# Altium project MRv2.PrjPCB
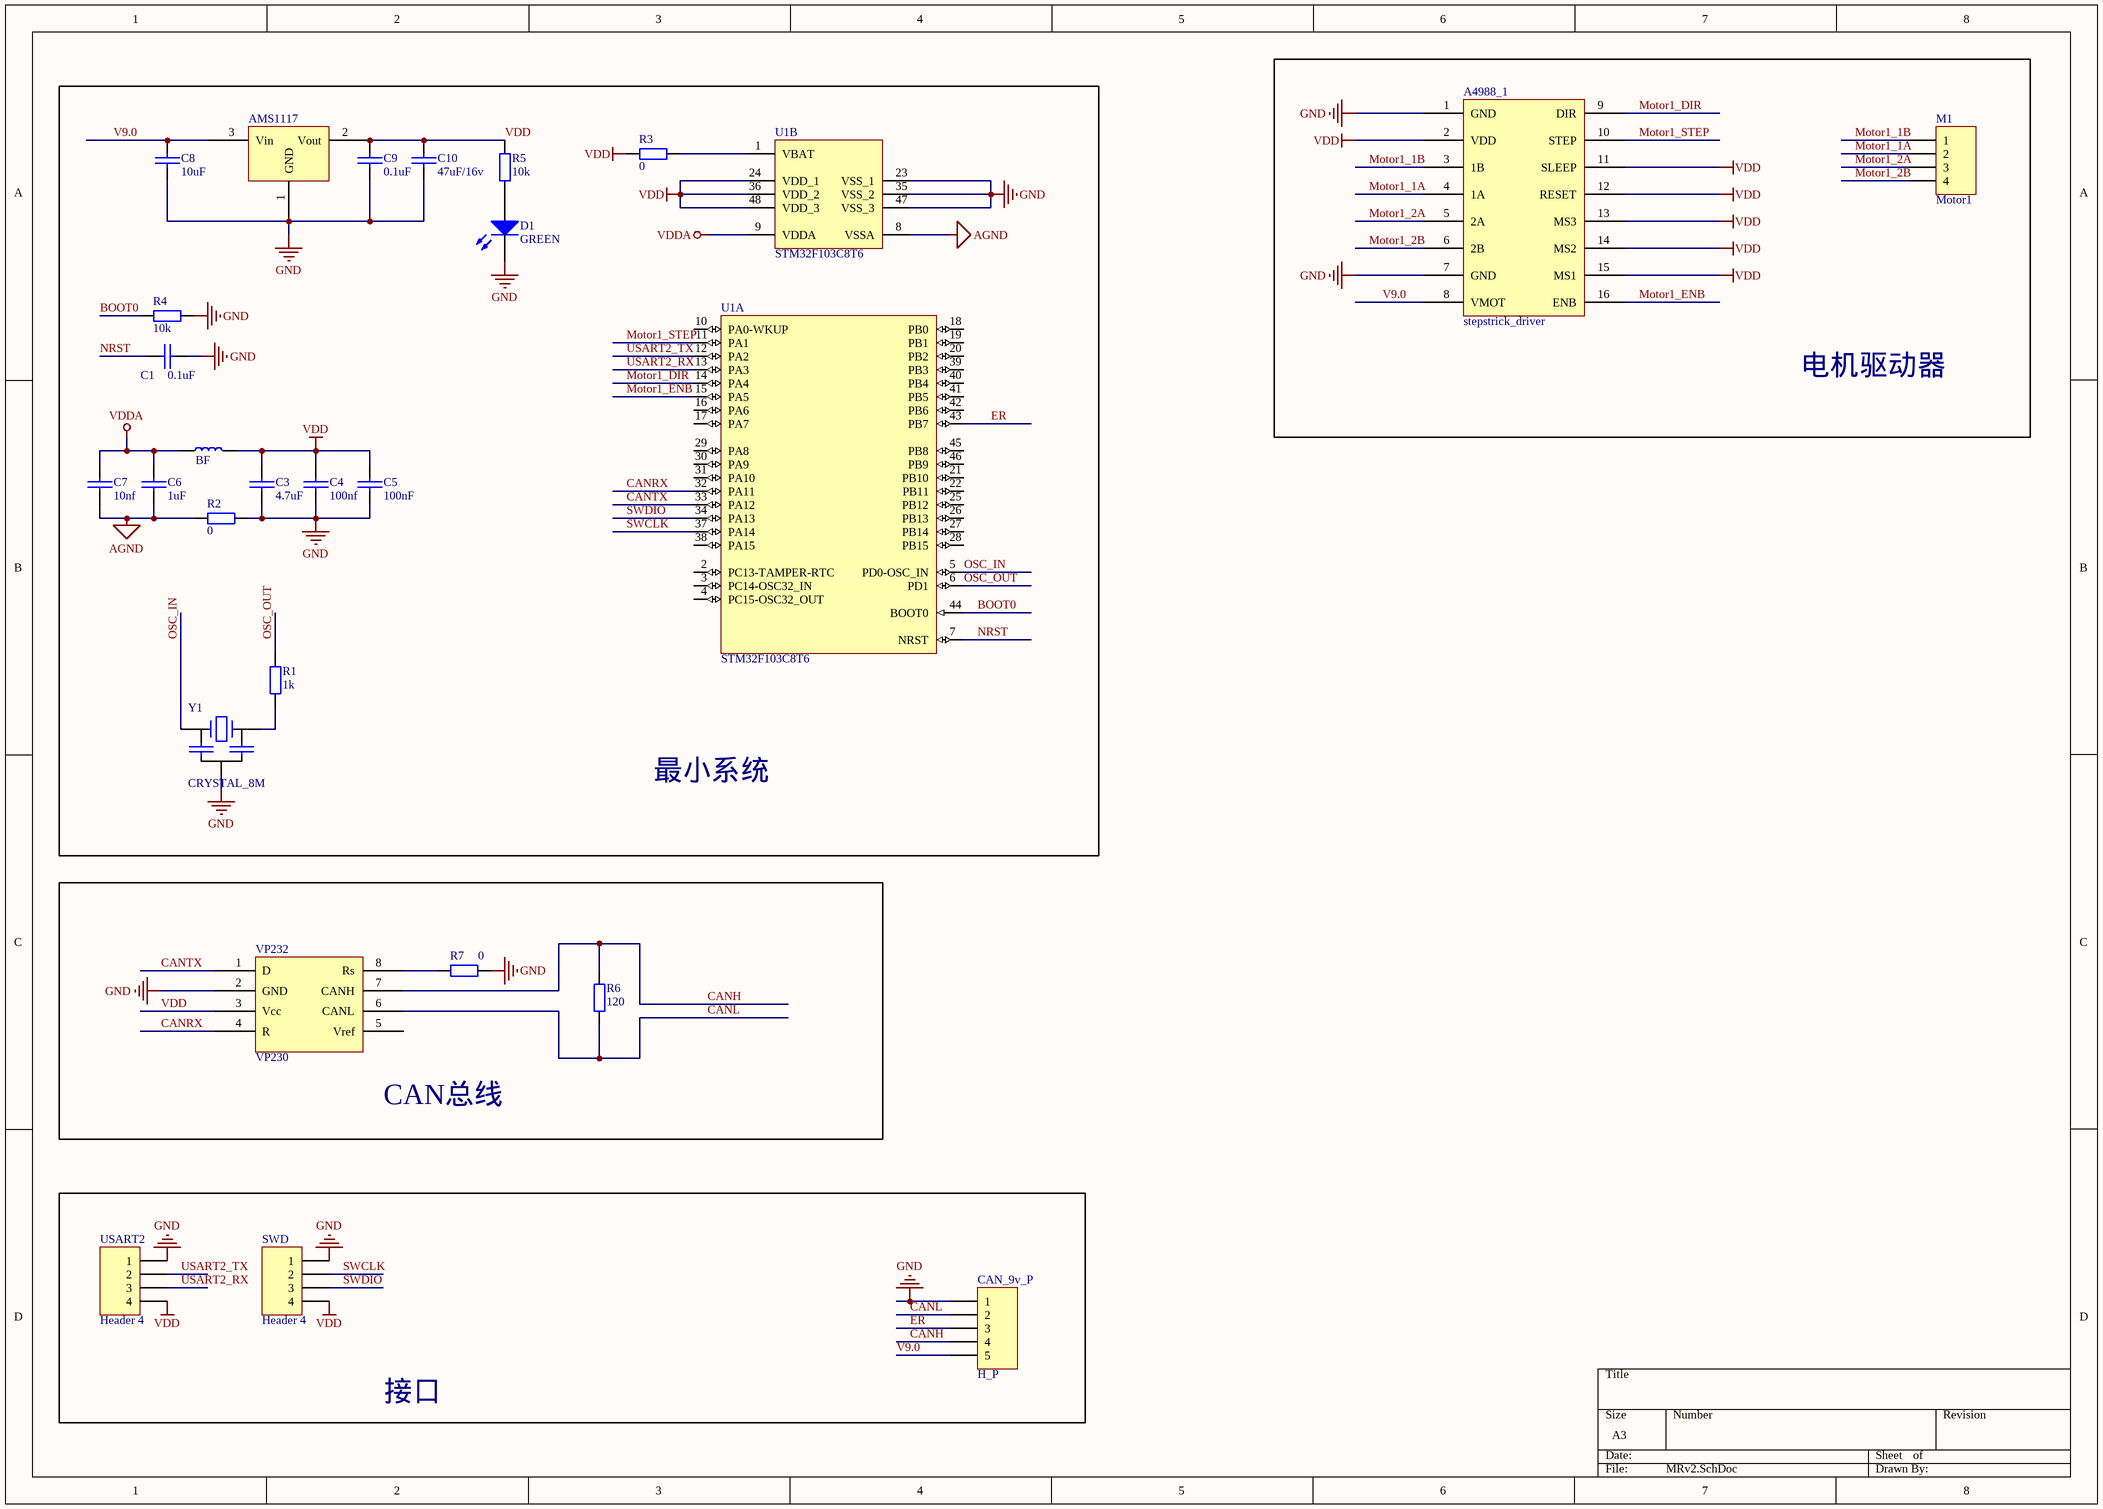
[diagram p0: MRv2.SchDoc]
1 sheet, 27 parts. Net scope: global (net labels, ports and power ports of the same name join across sheets).
Board file: MRv2.PcbDoc

## Sheet MRv2.SchDoc
size A3

### Parts
A4988_1  stepstrick_driver  [A4988]
AMS1117  ASM1117  [SOT223]  (value not drawn)
BF  BF  [R1608[0603]]  (value not drawn)
C1  value 0.1uF  [C1608[0603]N]  (hidden comment: cap smd)
C3  value 4.7uF  [C1608[0603]N]  (hidden comment: cap smd)
C4  value 100nf  [C1608[0603]N]  (hidden comment: cap smd)
C5  value 100nF  [C1608[0603]N]  (hidden comment: cap smd)
C6  value 1uF  [C1608[0603]N]  (hidden comment: cap smd)
C7  value 10nf  [C1608[0603]N]  (hidden comment: cap smd)
C8  value 10uF  [C1608[0603]N]  (hidden comment: cap smd)
C9  value 0.1uF  [C1608[0603]N]  (hidden comment: cap smd)
C10  value 47uF/16v  [C1608[0603]N]  (hidden comment: cap smd)
CAN_9v_P  H_P  [HDR1X5]
D1  value GREEN  [D1608[0603]]  (hidden comment: LED)
M1  Motor1  [HDR1X4]
R1  value 1k  [R1608[0603]]  (hidden comment: RES1)
R2  value 0  [R1608[0603]]  (hidden comment: RES1)
R3  value 0  [1608[0603]]  (hidden comment: RES1)
R4  value 10k  [1608[0603]]  (hidden comment: RES1)
R5  value 10k  [R1608[0603]]  (hidden comment: RES1)
R6  value 120  [R1608[0603]]  (hidden comment: RES1)
R7  value 0  [R1608[0603]]  (hidden comment: RES1)
SWD  Header 4  [HDR1X4]
U1  STM32F103C8T6  [LQFP48_N]  (parts A,B of 2)
USART2  Header 4  [HDR1X4]
VP232  VP230  [VP232]
Y1  CRYSTAL_8M  [Crystal_C]

### Blocks framed on the sheet
电机驱动器: A4988_1 M1
最小系统: AMS1117 BF C1 C3-C10 D1 R1-R5 U1 Y1
CAN总线: R6 R7 VP232
接口: CAN_9v_P SWD USART2

### Nets
AGND: C6.2 C7.2 R2.1 U1.8(VSSA)
GND: A4988_1.1(GND) A4988_1.7(GND) AMS1117.1(GND) C1.1 C3.2 C4.2 C5.2 C8.2 C9.2 C10.2 CAN_9v_P.1 D1.2(K) R2.2 R4.1 R7.2 SWD.1 U1.23(VSS_1) U1.35(VSS_2) U1.47(VSS_3) USART2.1 VP232.2(GND) Y1.2(GND)
VDD: A4988_1.2(VDD) A4988_1.11(SLEEP) A4988_1.12(RESET) A4988_1.13(MS3) A4988_1.14(MS2) A4988_1.15(MS1) AMS1117.2(Vout) BF.2 C3.1 C4.1 C5.1 C9.1 C10.1 R3.1 R5.2 SWD.4 U1.24(VDD_1) U1.36(VDD_2) U1.48(VDD_3) USART2.4 VP232.3(Vcc)
VDDA: BF.1 C6.1 C7.1 U1.9(VDDA)
BOOT0: R4.2 U1.44(BOOT0)
CANH: CAN_9v_P.4 R6.2 VP232.7(CANH)
CANL: CAN_9v_P.2 R6.1 VP232.6(CANL)
CANRX: U1.32(PA11) VP232.4(R)
CANTX: U1.33(PA12) VP232.1(D)
ER: CAN_9v_P.3 U1.43(PB7)
Motor1_1A: A4988_1.4(1A) M1.2
Motor1_1B: A4988_1.3(1B) M1.1
Motor1_2A: A4988_1.5(2A) M1.3
Motor1_2B: A4988_1.6(2B) M1.4
Motor1_DIR: A4988_1.9(DIR) U1.14(PA4)
Motor1_ENB: A4988_1.16(ENB) U1.15(PA5)
Motor1_STEP: A4988_1.10(STEP) U1.11(PA1)
NRST: C1.2 U1.7(NRST)
OSC_IN: U1.5(PD0-OSC_IN) Y1.1
OSC_OUT: R1.2 U1.6(PD1)
SWCLK: SWD.2 U1.37(PA14)
SWDIO: SWD.3 U1.34(PA13)
USART2_RX: U1.13(PA3) USART2.3
USART2_TX: U1.12(PA2) USART2.2
V9.0: A4988_1.8(VMOT) AMS1117.3(Vin) C8.1 CAN_9v_P.5
NetD1_1: D1.1(A) R5.1
NetR1_1: R1.1 Y1.3
NetR3_2: R3.2 U1.1(VBAT)
NetR7_1: R7.1 VP232.8(Rs)

Not connected (* = marked no-connect by the designer): U1 2(PC13-TAMPER-RTC) 3(PC14-OSC32_IN) 4(PC15-OSC32_OUT) 10(PA0-WKUP) 16(PA6) 17(PA7) 18(PB0) 19(PB1) 20(PB2) 21(PB10) 22(PB11) 25(PB12) 26(PB13) 27(PB14) 28(PB15) 29(PA8) 30(PA9) 31(PA10) 38(PA15) 39(PB3) 40(PB4) 41(PB5) 42(PB6) 45(PB8) 46(PB9); VP232 5(Vref)

### Library data of the parts
BF = BF: 磁珠
C1 C3-C10 = CAP: 贴片无极性电容
CAN_9v_P = Header 5: Header, 5-Pin; LatestRevisionDate: 17-Jul-2002; LatestRevisionNote: Re-released for DXP Platform.; Publisher: Altium Limited
D1 = LED: 蓝色 LED; Published: 8-Jun-2000; LatestRevisionDate: 08-Jul-2005; LatestRevisionNote: Mech Layer 1 removed.; Publisher: Altium Limited
M1 SWD USART2 = Header 4: Header, 4-Pin; LatestRevisionDate: 17-Jul-2002; LatestRevisionNote: Re-released for DXP Platform.; Publisher: Altium Limited
U1 = STM32F103C8T6: STM32 ARM-based 32-bit MCU Performance Line with 64 kB Flash, 20 kB Internal RAM, -40 to +85癈 Temperature, 48-Pin LQFP, Tray; DatasheetVersion: rev13.0, Apr-2011; PackageVersion: rev13, Apr-2011; PackageReference: LQFP48; PackageDescription: 48-Pin Low-Profile Quad Flat Pack, 7 x 7 mm Body, 0.5 mm Pitch (LQFP48); ComponentLink1Description: Manufacturer URL; ComponentLink1URL: http://www.st.com/; ComponentLink2Description: STM32F103 Datasheet; ComponentLink2URL: http://www.st.com/internet/com/TECHNICAL_RESOURCES/TECHNICAL_LITERATURE/DATASHEET/CD00161566.pdf; ComponentLink3Description: STM32 Family Web Page; ComponentLink3URL: www.st.com/stm32
VP232 = Component_1
Y1 = CRYSTAL_C